# Altium project DRV8825 Printplaat.PrjPCB
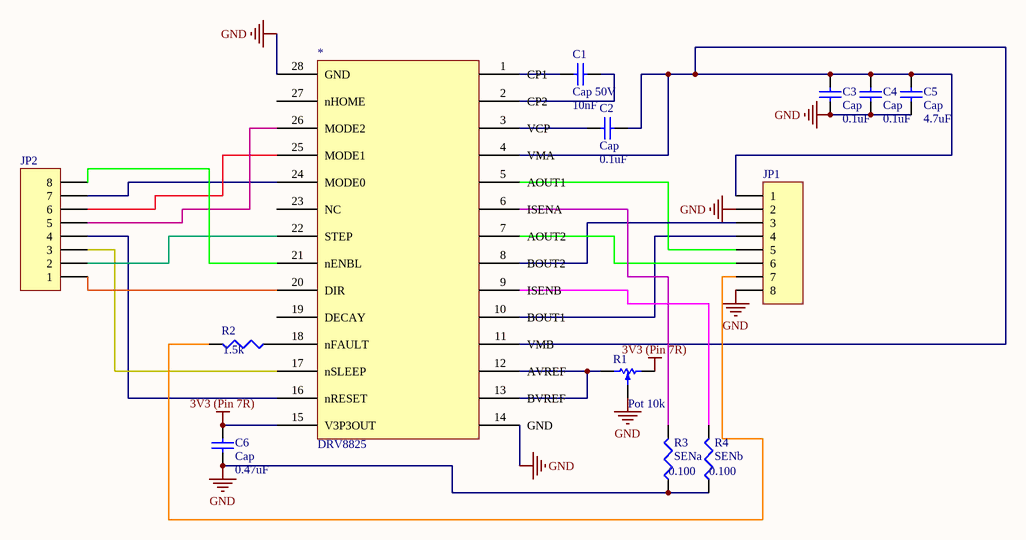
[diagram p0: Stepper driver met DVR8825 Pololu compatible.SchDoc]
1 sheet, 13 parts. Net scope: global (net labels, ports and power ports of the same name join across sheets).
Board file: DRV8825 Printplaat.PcbDoc

## Sheet Stepper driver met DVR8825 Pololu compatible.SchDoc
size A4

### Parts
*  DRV8825  [DRV8825]
C1  Cap 50V  value 10nF  [CAPC1608M]
C2  Cap  value 0.1uF  [CAPC1608M]
C3  Cap  value 0.1uF  [CAPC1608M]
C4  Cap  value 0.1uF  [CAPC1608M]
C5  Cap  value 4.7uF  [C1210]
C6  Cap  value 0.47uF  [CAPC1608M]
JP1  eader 8  [HDR1X8 ZONDER OMLIJNING]  (value not drawn)
JP2  (no value)  [HDR1X8 ZONDER OMLIJNING]
R1  Pot 10k  [POT5MM]
R2  value 1.5k  [RESC1608M]
R3  SENa  value 0.100  [RESC2012M]
R4  SENb  value 0.100  [RESC2012M]

### Nets
3V3 (Pin 7R): *.15(V3P3OUT) C6.2 R1.CW(+)
GND: *.28(GND) C3.1 C4.1 C5.1 C6.1 JP1.2 JP1.8 R1.W R3.1 R4.1
Net*_16: *.16(nRESET) JP2.4
Net*_17: *.17(nSLEEP) JP2.3
Net*_18: *.18(nFAULT) R2.1
Net*_20: *.20(DIR) JP2.1
Net*_21: *.21(nENBL) JP2.8
Net*_22: *.22(STEP) JP2.2
Net*_24: *.24(MODE0) JP2.7
Net*_25: *.25(MODE1) JP2.6
Net*_26: *.26(MODE2) JP2.5
NetC2_1: C2.1 C3.2 C4.2 C5.2 JP1.1
NetJP1_7: JP1.7 R2.2

Not connected (* = marked no-connect by the designer): * 1(CP1) 2(CP2) 3(VCP) 4(VMA) 5(AOUT1) 6(ISENA) 7(AOUT2) 8(BOUT2) 9(ISENB) 10(BOUT1) 11(VMB) 12(AVREF) 13(BVREF) 14(GND) 19(DECAY) 23(NC) 27(nHOME); C1 1 2; C2 2; JP1 3 4 5 6; R1 CCW(-); R3 2; R4 2

### Library data of the parts
C1-C6 = Cap Semi: Capacitor (Semiconductor SIM Model); Published: 8-Jun-2000; LatestRevisionDate: 29-May-2009; LatestRevisionNote: IPC-7351 Footprint Added.; PackageReference: C1206; Publisher: Altium Limited; PackageDescription: Chip Capacitor
JP1 JP2 = Header 8: Header, 8-Pin; LatestRevisionDate: 17-Jul-2002; LatestRevisionNote: Re-released for DXP Platform.; Publisher: Altium Limited
R1 = RPot SM: Square Trimming Potentiometer; Published: 17-Dec-2003; DatasheetVersion: Oct-2003; PackageReference: POT4MM-2; Publisher: Altium Limited; PackageDescription: Square Trimming Potentiometer; ComponentLink1Description: Manufacturer Link; ComponentLink1URL: http://bourns.com/2/search.html
R2-R4 = Res3: Resistor; Published: 8-Jun-2000; LatestRevisionDate: 29-May-2009; LatestRevisionNote: IPC-7351 Footprint Added.; PackageReference: J1-0603; Publisher: Altium Limited; PackageDescription: Chip Resistor